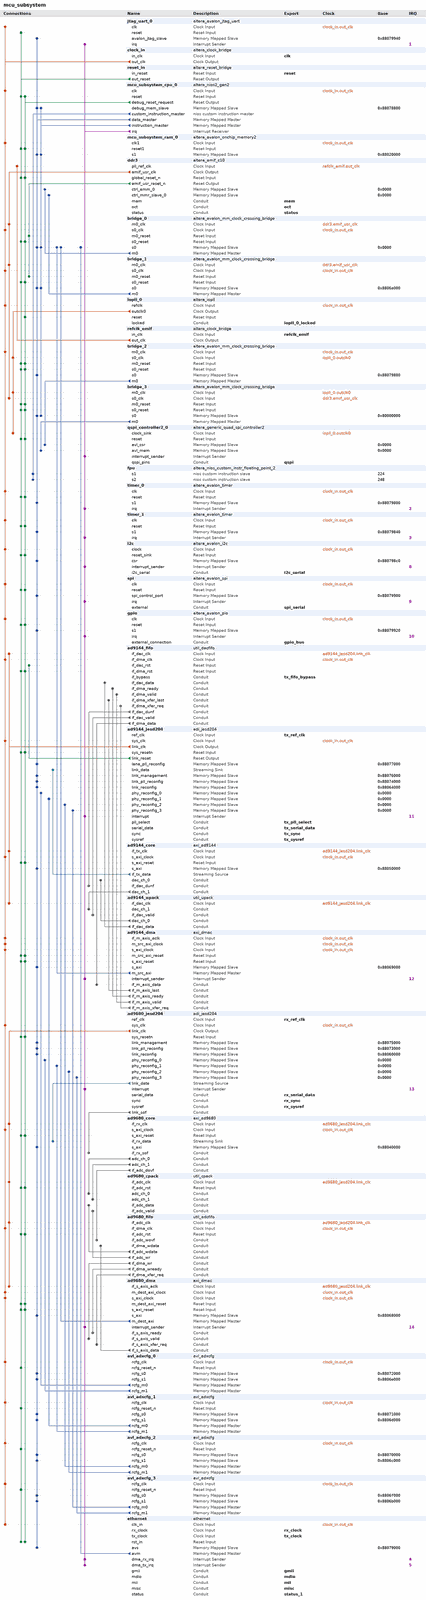
[diagram p0: system contents, whole]
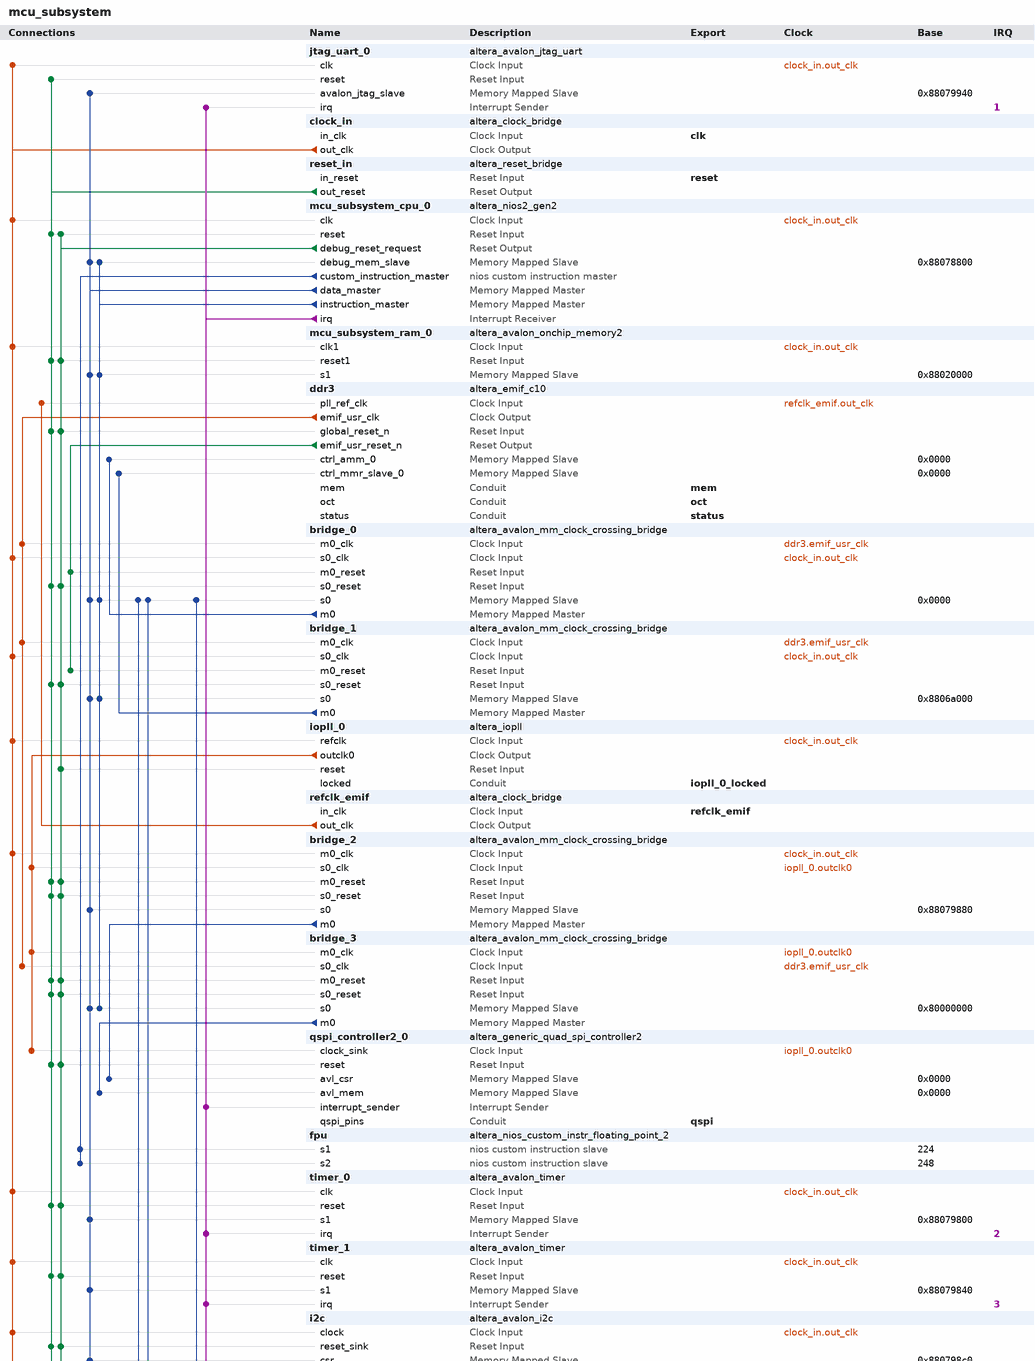
[diagram p1: system contents, upper part]
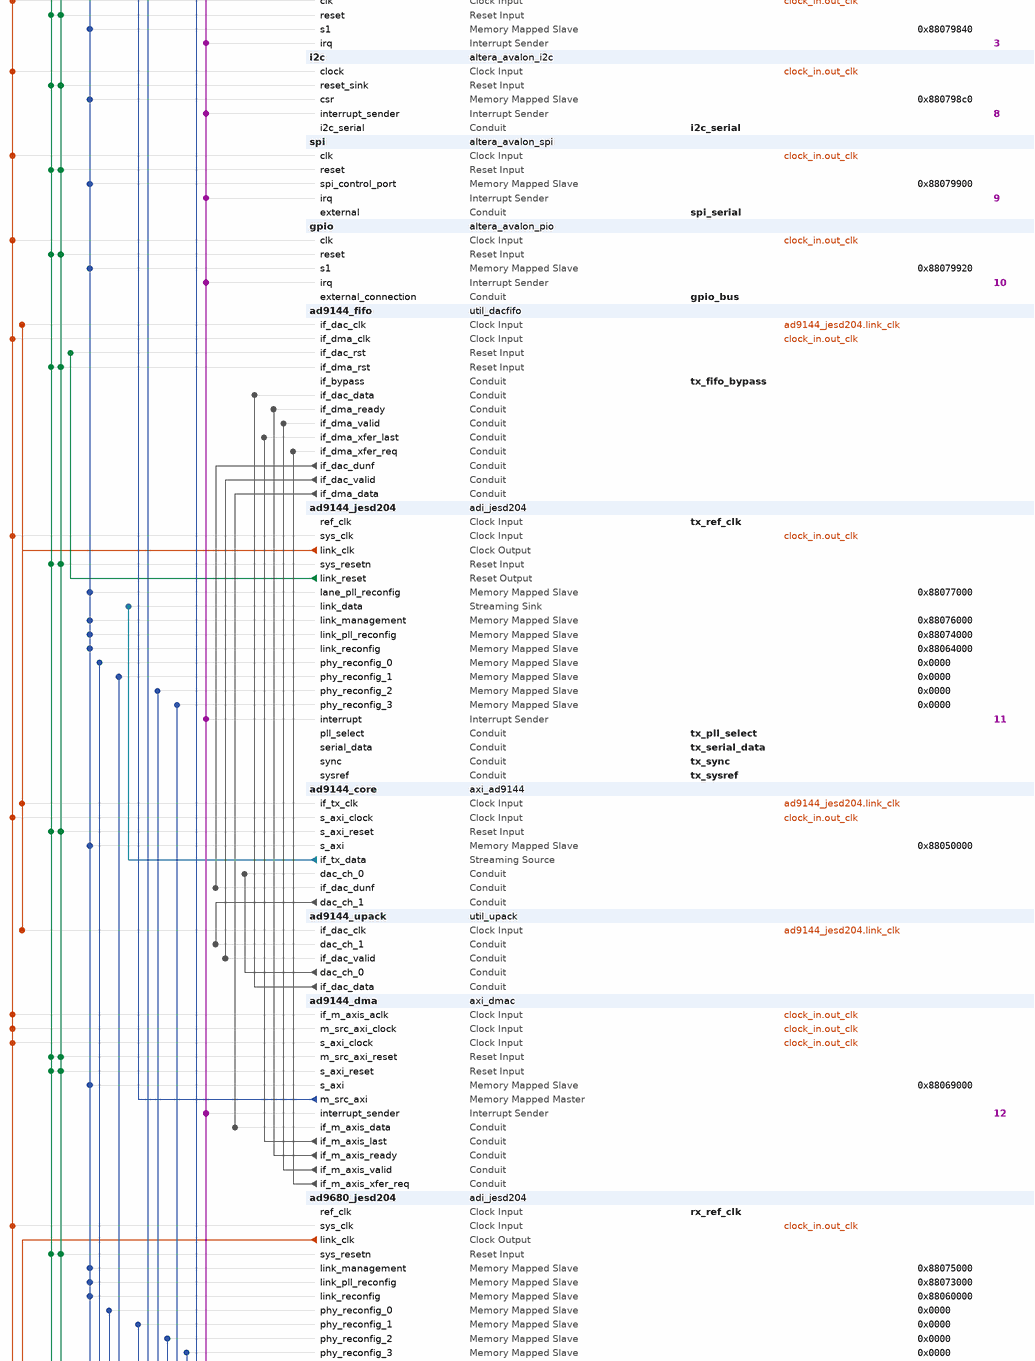
[diagram p2: system contents, middle part]
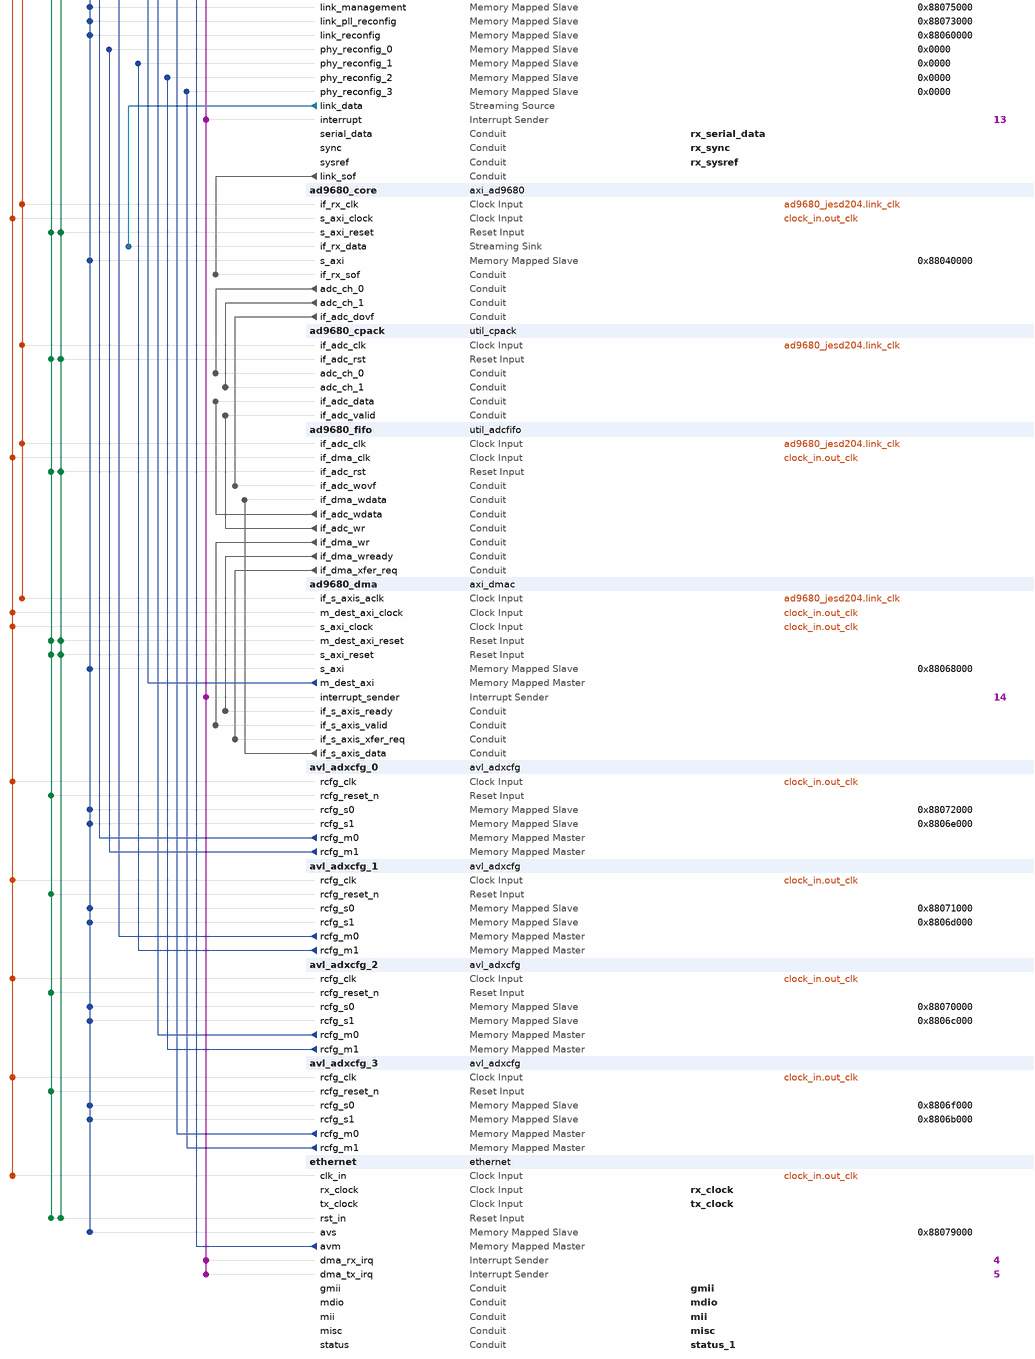
[diagram p3: system contents, lower part]
# Platform Designer (Qsys) system mcu_subsystem, Cyclone 10 GX 10CX220YF780I5G
# Parameters at their usual value, and those the tool derives, are not listed.
package require -exact qsys 1.0
create_system mcu_subsystem
set_project_property DEVICE_FAMILY {Cyclone 10 GX}
set_project_property DEVICE 10CX220YF780I5G

add_component jtag_uart_0 ip/mcu_subsystem/mcu_subsystem_jtag_uart_0.ip altera_avalon_jtag_uart jtag_uart_0 18.1
load_component jtag_uart_0
set_component_parameter_value simInteractiveOptions NO_INTERACTIVE_WINDOWS
save_component

add_component clock_in ip/mcu_subsystem/mcu_subsystem_clock_in.ip altera_clock_bridge clock_in 18.1

add_component reset_in ip/mcu_subsystem/mcu_subsystem_reset_in.ip altera_reset_bridge reset_in 18.1

add_component mcu_subsystem_cpu_0 ip/mcu_subsystem/mcu_subsystem_cpu_0.ip altera_nios2_gen2 mcu_subsystem_cpu_0 18.1
load_component mcu_subsystem_cpu_0
set_component_parameter_value setting_support31bitdcachebypass false
set_component_parameter_value resetSlave ddr3.ctrl_amm_0
set_component_parameter_value exceptionSlave ddr3.ctrl_amm_0
set_component_parameter_value mul_shift_choice 1
set_component_parameter_value mul_64_impl 1
set_component_parameter_value dividerType srt2
set_component_parameter_value impl Fast
set_component_parameter_value icache_size 4096
set_component_parameter_value dcache_size 2048
save_component

add_component mcu_subsystem_ram_0 ip/mcu_subsystem/mcu_subsystem_ram_0.ip altera_avalon_onchip_memory2 mcu_subsystem_ram_0 18.1

add_component ddr3 ip/mcu_subsystem/ddr3.ip altera_emif_c10 ddr3 18.1
load_component ddr3
set_component_parameter_value FAMILY_ENUM FAMILY_CYCLONE10GX
set_component_parameter_value TRAIT_SUPPORTS_VID 0
set_component_parameter_value PROTOCOL_ENUM PROTOCOL_DDR3
set_component_parameter_value IS_ED_SLAVE false
set_component_parameter_value INTERNAL_TESTING_MODE false
set_component_parameter_value CAL_DEBUG_CLOCK_FREQUENCY 50000000
set_component_parameter_value PREV_PROTOCOL_ENUM PROTOCOL_DDR3
set_component_parameter_value PHY_FPGA_SPEEDGRADE_GUI {I5 (Production) - change device under 'View'->'Device Family'}
set_component_parameter_value PHY_TARGET_SPEEDGRADE I5
set_component_parameter_value PHY_TARGET_IS_ES false
set_component_parameter_value PHY_TARGET_IS_ES2 false
set_component_parameter_value PHY_TARGET_IS_ES3 false
set_component_parameter_value PHY_TARGET_IS_PRODUCTION true
set_component_parameter_value PHY_CONFIG_ENUM CONFIG_PHY_AND_HARD_CTRL
set_component_parameter_value PHY_PING_PONG_EN false
set_component_parameter_value PHY_CLAMSHELL_EN false
set_component_parameter_value PHY_RATE_ENUM RATE_QUARTER
set_component_parameter_value PHY_MEM_CLK_FREQ_MHZ 800.0
set_component_parameter_value PHY_REF_CLK_FREQ_MHZ 200.0
set_component_parameter_value PHY_REF_CLK_JITTER_PS 10.0
set_component_parameter_value PHY_CORE_CLKS_SHARING_ENUM CORE_CLKS_SHARING_DISABLED
set_component_parameter_value PHY_CORE_CLKS_SHARING_EXPOSE_SLAVE_OUT false
set_component_parameter_value PHY_CALIBRATED_OCT true
set_component_parameter_value PHY_AC_CALIBRATED_OCT false
set_component_parameter_value PHY_CK_CALIBRATED_OCT false
set_component_parameter_value PHY_DATA_CALIBRATED_OCT true
set_component_parameter_value PHY_RZQ 240
set_component_parameter_value PHY_HPS_ENABLE_EARLY_RELEASE false
set_component_parameter_value PHY_USER_PERIODIC_OCT_RECAL_ENUM PERIODIC_OCT_RECAL_AUTO
set_component_parameter_value PHY_AC_IO_STD_ENUM IO_STD_SSTL_135_C1
set_component_parameter_value PHY_CK_IO_STD_ENUM IO_STD_SSTL_135_C1
set_component_parameter_value PHY_DATA_IO_STD_ENUM IO_STD_SSTL_135
set_component_parameter_value PHY_AC_MODE_ENUM CURRENT_ST_12
set_component_parameter_value PHY_CK_MODE_ENUM CURRENT_ST_12
set_component_parameter_value PHY_DATA_OUT_MODE_ENUM OUT_OCT_34_CAL
set_component_parameter_value PLL_ADD_EXTRA_CLKS false
set_component_parameter_value PLL_USER_NUM_OF_EXTRA_CLKS 0
set_component_parameter_value PLL_EXTRA_CLK_ACTUAL_FREQ_MHZ_GUI_0 0.0
set_component_parameter_value PLL_EXTRA_CLK_ACTUAL_PHASE_PS_GUI_0 0.0
set_component_parameter_value PLL_EXTRA_CLK_DESIRED_FREQ_MHZ_GUI_0 0.0
set_component_parameter_value PLL_EXTRA_CLK_PHASE_SHIFT_UNIT_GUI_0 ps
set_component_parameter_value PLL_EXTRA_CLK_DESIRED_PHASE_GUI_0 0.0
set_component_parameter_value PLL_EXTRA_CLK_ACTUAL_PHASE_DEG_GUI_0 0.0
set_component_parameter_value PLL_EXTRA_CLK_DESIRED_DUTY_CYCLE_GUI_0 50.0
set_component_parameter_value PLL_EXTRA_CLK_ACTUAL_DUTY_CYCLE_GUI_0 50.0
set_component_parameter_value PLL_EXTRA_CLK_ACTUAL_DUTY_CYCLE_0 50.0
set_component_parameter_value PLL_EXTRA_CLK_ACTUAL_FREQ_MHZ_GUI_1 0.0
set_component_parameter_value PLL_EXTRA_CLK_ACTUAL_PHASE_PS_GUI_1 0.0
set_component_parameter_value PLL_EXTRA_CLK_DESIRED_FREQ_MHZ_GUI_1 0.0
set_component_parameter_value PLL_EXTRA_CLK_PHASE_SHIFT_UNIT_GUI_1 ps
set_component_parameter_value PLL_EXTRA_CLK_DESIRED_PHASE_GUI_1 0.0
set_component_parameter_value PLL_EXTRA_CLK_ACTUAL_PHASE_DEG_GUI_1 0.0
set_component_parameter_value PLL_EXTRA_CLK_DESIRED_DUTY_CYCLE_GUI_1 50.0
set_component_parameter_value PLL_EXTRA_CLK_ACTUAL_DUTY_CYCLE_GUI_1 50.0
set_component_parameter_value PLL_EXTRA_CLK_ACTUAL_DUTY_CYCLE_1 50.0
set_component_parameter_value PLL_EXTRA_CLK_ACTUAL_FREQ_MHZ_GUI_2 0.0
set_component_parameter_value PLL_EXTRA_CLK_ACTUAL_PHASE_PS_GUI_2 0.0
set_component_parameter_value PLL_EXTRA_CLK_DESIRED_FREQ_MHZ_GUI_2 0.0
set_component_parameter_value PLL_EXTRA_CLK_PHASE_SHIFT_UNIT_GUI_2 ps
set_component_parameter_value PLL_EXTRA_CLK_DESIRED_PHASE_GUI_2 0.0
set_component_parameter_value PLL_EXTRA_CLK_ACTUAL_PHASE_DEG_GUI_2 0.0
set_component_parameter_value PLL_EXTRA_CLK_DESIRED_DUTY_CYCLE_GUI_2 50.0
set_component_parameter_value PLL_EXTRA_CLK_ACTUAL_DUTY_CYCLE_GUI_2 50.0
set_component_parameter_value PLL_EXTRA_CLK_ACTUAL_DUTY_CYCLE_2 50.0
set_component_parameter_value PLL_EXTRA_CLK_ACTUAL_FREQ_MHZ_GUI_3 0.0
set_component_parameter_value PLL_EXTRA_CLK_ACTUAL_PHASE_PS_GUI_3 0.0
set_component_parameter_value PLL_EXTRA_CLK_DESIRED_FREQ_MHZ_GUI_3 0.0
set_component_parameter_value PLL_EXTRA_CLK_PHASE_SHIFT_UNIT_GUI_3 ps
set_component_parameter_value PLL_EXTRA_CLK_DESIRED_PHASE_GUI_3 0.0
set_component_parameter_value PLL_EXTRA_CLK_ACTUAL_PHASE_DEG_GUI_3 0.0
set_component_parameter_value PLL_EXTRA_CLK_DESIRED_DUTY_CYCLE_GUI_3 50.0
set_component_parameter_value PLL_EXTRA_CLK_ACTUAL_DUTY_CYCLE_GUI_3 50.0
set_component_parameter_value PLL_EXTRA_CLK_ACTUAL_DUTY_CYCLE_3 50.0
set_component_parameter_value PLL_EXTRA_CLK_ACTUAL_FREQ_MHZ_GUI_4 0.0
set_component_parameter_value PLL_EXTRA_CLK_ACTUAL_PHASE_PS_GUI_4 0.0
set_component_parameter_value PLL_EXTRA_CLK_DESIRED_FREQ_MHZ_GUI_4 0.0
set_component_parameter_value PLL_EXTRA_CLK_PHASE_SHIFT_UNIT_GUI_4 ps
set_component_parameter_value PLL_EXTRA_CLK_DESIRED_PHASE_GUI_4 0.0
set_component_parameter_value PLL_EXTRA_CLK_ACTUAL_PHASE_DEG_GUI_4 0.0
set_component_parameter_value PLL_EXTRA_CLK_DESIRED_DUTY_CYCLE_GUI_4 50.0
set_component_parameter_value PLL_EXTRA_CLK_ACTUAL_DUTY_CYCLE_GUI_4 50.0
set_component_parameter_value PLL_EXTRA_CLK_ACTUAL_DUTY_CYCLE_4 50.0
set_component_parameter_value PLL_EXTRA_CLK_ACTUAL_FREQ_MHZ_GUI_5 0.0
set_component_parameter_value PLL_EXTRA_CLK_ACTUAL_PHASE_PS_GUI_5 0.0
set_component_parameter_value PLL_EXTRA_CLK_DESIRED_FREQ_MHZ_GUI_5 0.0
set_component_parameter_value PLL_EXTRA_CLK_PHASE_SHIFT_UNIT_GUI_5 ps
set_component_parameter_value PLL_EXTRA_CLK_DESIRED_PHASE_GUI_5 0.0
set_component_parameter_value PLL_EXTRA_CLK_ACTUAL_PHASE_DEG_GUI_5 0.0
set_component_parameter_value PLL_EXTRA_CLK_DESIRED_DUTY_CYCLE_GUI_5 50.0
set_component_parameter_value PLL_EXTRA_CLK_ACTUAL_DUTY_CYCLE_GUI_5 50.0
set_component_parameter_value PLL_EXTRA_CLK_ACTUAL_DUTY_CYCLE_5 50.0
set_component_parameter_value PLL_EXTRA_CLK_ACTUAL_FREQ_MHZ_GUI_6 0.0
set_component_parameter_value PLL_EXTRA_CLK_ACTUAL_PHASE_PS_GUI_6 0.0
set_component_parameter_value PLL_EXTRA_CLK_DESIRED_FREQ_MHZ_GUI_6 0.0
set_component_parameter_value PLL_EXTRA_CLK_PHASE_SHIFT_UNIT_GUI_6 ps
set_component_parameter_value PLL_EXTRA_CLK_DESIRED_PHASE_GUI_6 0.0
set_component_parameter_value PLL_EXTRA_CLK_ACTUAL_PHASE_DEG_GUI_6 0.0
set_component_parameter_value PLL_EXTRA_CLK_DESIRED_DUTY_CYCLE_GUI_6 50.0
set_component_parameter_value PLL_EXTRA_CLK_ACTUAL_DUTY_CYCLE_GUI_6 50.0
set_component_parameter_value PLL_EXTRA_CLK_ACTUAL_DUTY_CYCLE_6 50.0
set_component_parameter_value PLL_EXTRA_CLK_ACTUAL_FREQ_MHZ_GUI_7 0.0
set_component_parameter_value PLL_EXTRA_CLK_ACTUAL_PHASE_PS_GUI_7 0.0
set_component_parameter_value PLL_EXTRA_CLK_DESIRED_FREQ_MHZ_GUI_7 0.0
set_component_parameter_value PLL_EXTRA_CLK_PHASE_SHIFT_UNIT_GUI_7 ps
set_component_parameter_value PLL_EXTRA_CLK_DESIRED_PHASE_GUI_7 0.0
set_component_parameter_value PLL_EXTRA_CLK_ACTUAL_PHASE_DEG_GUI_7 0.0
set_component_parameter_value PLL_EXTRA_CLK_DESIRED_DUTY_CYCLE_GUI_7 50.0
set_component_parameter_value PLL_EXTRA_CLK_ACTUAL_DUTY_CYCLE_GUI_7 50.0
set_component_parameter_value PLL_EXTRA_CLK_ACTUAL_DUTY_CYCLE_7 50.0
set_component_parameter_value PLL_EXTRA_CLK_ACTUAL_FREQ_MHZ_GUI_8 0.0
set_component_parameter_value PLL_EXTRA_CLK_ACTUAL_PHASE_PS_GUI_8 0.0
set_component_parameter_value PLL_EXTRA_CLK_DESIRED_FREQ_MHZ_GUI_8 0.0
set_component_parameter_value PLL_EXTRA_CLK_PHASE_SHIFT_UNIT_GUI_8 ps
set_component_parameter_value PLL_EXTRA_CLK_DESIRED_PHASE_GUI_8 0.0
set_component_parameter_value PLL_EXTRA_CLK_ACTUAL_PHASE_DEG_GUI_8 0.0
set_component_parameter_value PLL_EXTRA_CLK_DESIRED_DUTY_CYCLE_GUI_8 50.0
set_component_parameter_value PLL_EXTRA_CLK_ACTUAL_DUTY_CYCLE_GUI_8 50.0
set_component_parameter_value PLL_EXTRA_CLK_ACTUAL_DUTY_CYCLE_8 50.0
set_component_parameter_value PLL_VCO_CLK_FREQ_MHZ 800.0
set_component_parameter_value PLL_NUM_OF_EXTRA_CLKS 0
set_component_parameter_value PLL_EXTRA_CLK_ACTUAL_FREQ_MHZ_0 0.0
set_component_parameter_value PLL_EXTRA_CLK_ACTUAL_PHASE_PS_0 0.0
set_component_parameter_value PLL_EXTRA_CLK_ACTUAL_FREQ_MHZ_1 0.0
set_component_parameter_value PLL_EXTRA_CLK_ACTUAL_PHASE_PS_1 0.0
set_component_parameter_value PLL_EXTRA_CLK_ACTUAL_FREQ_MHZ_2 0.0
set_component_parameter_value PLL_EXTRA_CLK_ACTUAL_PHASE_PS_2 0.0
set_component_parameter_value PLL_EXTRA_CLK_ACTUAL_FREQ_MHZ_3 0.0
set_component_parameter_value PLL_EXTRA_CLK_ACTUAL_PHASE_PS_3 0.0
set_component_parameter_value PLL_EXTRA_CLK_ACTUAL_FREQ_MHZ_4 0.0
set_component_parameter_value PLL_EXTRA_CLK_ACTUAL_PHASE_PS_4 0.0
set_component_parameter_value PLL_EXTRA_CLK_ACTUAL_FREQ_MHZ_5 800.0
set_component_parameter_value PLL_EXTRA_CLK_ACTUAL_PHASE_PS_5 0.0
set_component_parameter_value PLL_EXTRA_CLK_ACTUAL_FREQ_MHZ_6 800.0
set_component_parameter_value PLL_EXTRA_CLK_ACTUAL_PHASE_PS_6 0.0
set_component_parameter_value PLL_EXTRA_CLK_ACTUAL_FREQ_MHZ_7 800.0
set_component_parameter_value PLL_EXTRA_CLK_ACTUAL_PHASE_PS_7 0.0
set_component_parameter_value PLL_EXTRA_CLK_ACTUAL_FREQ_MHZ_8 800.0
set_component_parameter_value PLL_EXTRA_CLK_ACTUAL_PHASE_PS_8 0.0
set_component_parameter_value PHY_DDR3_CONFIG_ENUM CONFIG_PHY_AND_HARD_CTRL
set_component_parameter_value PHY_DDR3_USER_PING_PONG_EN false
set_component_parameter_value PHY_DDR3_MEM_CLK_FREQ_MHZ 800.0
set_component_parameter_value PHY_DDR3_DEFAULT_REF_CLK_FREQ false
set_component_parameter_value PHY_DDR3_USER_REF_CLK_FREQ_MHZ 200.0
set_component_parameter_value PHY_DDR3_REF_CLK_JITTER_PS 10.0
set_component_parameter_value PHY_DDR3_RATE_ENUM RATE_QUARTER
set_component_parameter_value PHY_DDR3_CORE_CLKS_SHARING_ENUM CORE_CLKS_SHARING_DISABLED
set_component_parameter_value PHY_DDR3_CORE_CLKS_SHARING_EXPOSE_SLAVE_OUT false
set_component_parameter_value PHY_DDR3_IO_VOLTAGE 1.35
set_component_parameter_value PHY_DDR3_DEFAULT_IO true
set_component_parameter_value PHY_DDR3_HPS_ENABLE_EARLY_RELEASE false
set_component_parameter_value PHY_DDR3_USER_PERIODIC_OCT_RECAL_ENUM PERIODIC_OCT_RECAL_AUTO
set_component_parameter_value PHY_DDR3_REF_CLK_FREQ_MHZ 200.0
set_component_parameter_value PHY_DDR3_PING_PONG_EN false
set_component_parameter_value PHY_DDR3_USER_AC_IO_STD_ENUM IO_STD_SSTL_15_C1
set_component_parameter_value PHY_DDR3_USER_AC_MODE_ENUM CURRENT_ST_12
set_component_parameter_value PHY_DDR3_USER_AC_SLEW_RATE_ENUM SLEW_RATE_FAST
set_component_parameter_value PHY_DDR3_USER_CK_IO_STD_ENUM IO_STD_SSTL_15_C1
set_component_parameter_value PHY_DDR3_USER_CK_MODE_ENUM CURRENT_ST_12
set_component_parameter_value PHY_DDR3_USER_CK_SLEW_RATE_ENUM SLEW_RATE_FAST
set_component_parameter_value PHY_DDR3_USER_DATA_IO_STD_ENUM IO_STD_SSTL_15
set_component_parameter_value PHY_DDR3_USER_DATA_OUT_MODE_ENUM OUT_OCT_34_CAL
set_component_parameter_value PHY_DDR3_USER_DATA_IN_MODE_ENUM IN_OCT_120_CAL
set_component_parameter_value PHY_DDR3_USER_AUTO_STARTING_VREFIN_EN true
set_component_parameter_value PHY_DDR3_USER_STARTING_VREFIN 50.0
set_component_parameter_value PHY_DDR3_USER_PLL_REF_CLK_IO_STD_ENUM IO_STD_LVDS
set_component_parameter_value PHY_DDR3_USER_RZQ_IO_STD_ENUM IO_STD_CMOS_15
set_component_parameter_value PHY_DDR3_AC_IO_STD_ENUM IO_STD_SSTL_135_C1
set_component_parameter_value PHY_DDR3_AC_MODE_ENUM CURRENT_ST_12
set_component_parameter_value PHY_DDR3_AC_SLEW_RATE_ENUM SLEW_RATE_SLOW
set_component_parameter_value PHY_DDR3_CK_IO_STD_ENUM IO_STD_SSTL_135_C1
set_component_parameter_value PHY_DDR3_CK_MODE_ENUM CURRENT_ST_12
set_component_parameter_value PHY_DDR3_CK_SLEW_RATE_ENUM SLEW_RATE_SLOW
set_component_parameter_value PHY_DDR3_DATA_IO_STD_ENUM IO_STD_SSTL_135
set_component_parameter_value PHY_DDR3_DATA_OUT_MODE_ENUM OUT_OCT_34_CAL
set_component_parameter_value PHY_DDR3_DATA_IN_MODE_ENUM IN_OCT_120_CAL
set_component_parameter_value PHY_DDR3_AUTO_STARTING_VREFIN_EN true
set_component_parameter_value PHY_DDR3_STARTING_VREFIN 50.0
set_component_parameter_value PHY_DDR3_PLL_REF_CLK_IO_STD_ENUM IO_STD_LVDS
set_component_parameter_value PHY_DDR3_RZQ_IO_STD_ENUM IO_STD_SSTL_135
set_component_parameter_value PHY_DDR3_CAL_ADDR0 0
set_component_parameter_value PHY_DDR3_CAL_ADDR1 8
set_component_parameter_value PHY_DDR3_CAL_ENABLE_NON_DES false
set_component_parameter_value PHY_DDR4_CONFIG_ENUM CONFIG_PHY_AND_HARD_CTRL
set_component_parameter_value PHY_DDR4_USER_PING_PONG_EN false
set_component_parameter_value PHY_DDR4_USER_CLAMSHELL_EN false
set_component_parameter_value PHY_DDR4_MEM_CLK_FREQ_MHZ 1200.0
set_component_parameter_value PHY_DDR4_DEFAULT_REF_CLK_FREQ true
set_component_parameter_value PHY_DDR4_USER_REF_CLK_FREQ_MHZ -1.0
set_component_parameter_value PHY_DDR4_REF_CLK_JITTER_PS 10.0
set_component_parameter_value PHY_DDR4_RATE_ENUM RATE_QUARTER
set_component_parameter_value PHY_DDR4_CORE_CLKS_SHARING_ENUM CORE_CLKS_SHARING_DISABLED
set_component_parameter_value PHY_DDR4_CORE_CLKS_SHARING_EXPOSE_SLAVE_OUT false
set_component_parameter_value PHY_DDR4_IO_VOLTAGE 1.2
set_component_parameter_value PHY_DDR4_DEFAULT_IO true
set_component_parameter_value PHY_DDR4_HPS_ENABLE_EARLY_RELEASE false
set_component_parameter_value PHY_DDR4_USER_PERIODIC_OCT_RECAL_ENUM PERIODIC_OCT_RECAL_AUTO
set_component_parameter_value PHY_DDR4_REF_CLK_FREQ_MHZ -1.0
set_component_parameter_value PHY_DDR4_PING_PONG_EN false
set_component_parameter_value PHY_DDR4_CLAMSHELL_EN false
set_component_parameter_value PHY_DDR4_USER_AC_IO_STD_ENUM unset
set_component_parameter_value PHY_DDR4_USER_AC_MODE_ENUM unset
set_component_parameter_value PHY_DDR4_USER_AC_SLEW_RATE_ENUM SLEW_RATE_FAST
set_component_parameter_value PHY_DDR4_USER_CK_IO_STD_ENUM unset
set_component_parameter_value PHY_DDR4_USER_CK_MODE_ENUM unset
set_component_parameter_value PHY_DDR4_USER_CK_SLEW_RATE_ENUM SLEW_RATE_FAST
set_component_parameter_value PHY_DDR4_USER_DATA_IO_STD_ENUM unset
set_component_parameter_value PHY_DDR4_USER_DATA_OUT_MODE_ENUM unset
set_component_parameter_value PHY_DDR4_USER_DATA_IN_MODE_ENUM unset
set_component_parameter_value PHY_DDR4_USER_AUTO_STARTING_VREFIN_EN true
set_component_parameter_value PHY_DDR4_USER_STARTING_VREFIN 70.0
set_component_parameter_value PHY_DDR4_USER_PLL_REF_CLK_IO_STD_ENUM unset
set_component_parameter_value PHY_DDR4_USER_RZQ_IO_STD_ENUM unset
set_component_parameter_value PHY_DDR4_AC_IO_STD_ENUM unset
set_component_parameter_value PHY_DDR4_AC_MODE_ENUM unset
set_component_parameter_value PHY_DDR4_AC_SLEW_RATE_ENUM SLEW_RATE_FAST
set_component_parameter_value PHY_DDR4_CK_IO_STD_ENUM unset
set_component_parameter_value PHY_DDR4_CK_MODE_ENUM unset
set_component_parameter_value PHY_DDR4_CK_SLEW_RATE_ENUM SLEW_RATE_FAST
set_component_parameter_value PHY_DDR4_DATA_IO_STD_ENUM unset
set_component_parameter_value PHY_DDR4_DATA_OUT_MODE_ENUM unset
set_component_parameter_value PHY_DDR4_DATA_IN_MODE_ENUM unset
set_component_parameter_value PHY_DDR4_AUTO_STARTING_VREFIN_EN true
set_component_parameter_value PHY_DDR4_STARTING_VREFIN 70.0
set_component_parameter_value PHY_DDR4_PLL_REF_CLK_IO_STD_ENUM unset
set_component_parameter_value PHY_DDR4_RZQ_IO_STD_ENUM unset
set_component_parameter_value PHY_QDR2_CONFIG_ENUM CONFIG_PHY_AND_SOFT_CTRL
set_component_parameter_value PHY_QDR2_USER_PING_PONG_EN false
set_component_parameter_value PHY_QDR2_MEM_CLK_FREQ_MHZ 633.333
set_component_parameter_value PHY_QDR2_DEFAULT_REF_CLK_FREQ true
set_component_parameter_value PHY_QDR2_USER_REF_CLK_FREQ_MHZ -1.0
set_component_parameter_value PHY_QDR2_REF_CLK_JITTER_PS 10.0
set_component_parameter_value PHY_QDR2_RATE_ENUM RATE_HALF
set_component_parameter_value PHY_QDR2_CORE_CLKS_SHARING_ENUM CORE_CLKS_SHARING_DISABLED
set_component_parameter_value PHY_QDR2_CORE_CLKS_SHARING_EXPOSE_SLAVE_OUT false
set_component_parameter_value PHY_QDR2_IO_VOLTAGE 1.5
set_component_parameter_value PHY_QDR2_DEFAULT_IO true
set_component_parameter_value PHY_QDR2_HPS_ENABLE_EARLY_RELEASE false
set_component_parameter_value PHY_QDR2_USER_PERIODIC_OCT_RECAL_ENUM PERIODIC_OCT_RECAL_AUTO
set_component_parameter_value PHY_QDR2_REF_CLK_FREQ_MHZ -1.0
set_component_parameter_value PHY_QDR2_PING_PONG_EN false
set_component_parameter_value PHY_QDR2_USER_AC_IO_STD_ENUM unset
set_component_parameter_value PHY_QDR2_USER_AC_MODE_ENUM unset
set_component_parameter_value PHY_QDR2_USER_AC_SLEW_RATE_ENUM SLEW_RATE_FAST
set_component_parameter_value PHY_QDR2_USER_CK_IO_STD_ENUM unset
set_component_parameter_value PHY_QDR2_USER_CK_MODE_ENUM unset
set_component_parameter_value PHY_QDR2_USER_CK_SLEW_RATE_ENUM SLEW_RATE_FAST
set_component_parameter_value PHY_QDR2_USER_DATA_IO_STD_ENUM unset
set_component_parameter_value PHY_QDR2_USER_DATA_OUT_MODE_ENUM unset
set_component_parameter_value PHY_QDR2_USER_DATA_IN_MODE_ENUM unset
set_component_parameter_value PHY_QDR2_USER_AUTO_STARTING_VREFIN_EN true
set_component_parameter_value PHY_QDR2_USER_STARTING_VREFIN 70.0
set_component_parameter_value PHY_QDR2_USER_PLL_REF_CLK_IO_STD_ENUM unset
set_component_parameter_value PHY_QDR2_USER_RZQ_IO_STD_ENUM unset
set_component_parameter_value PHY_QDR2_AC_IO_STD_ENUM unset
set_component_parameter_value PHY_QDR2_AC_MODE_ENUM unset
set_component_parameter_value PHY_QDR2_AC_SLEW_RATE_ENUM SLEW_RATE_FAST
set_component_parameter_value PHY_QDR2_CK_IO_STD_ENUM unset
set_component_parameter_value PHY_QDR2_CK_MODE_ENUM unset
set_component_parameter_value PHY_QDR2_CK_SLEW_RATE_ENUM SLEW_RATE_FAST
set_component_parameter_value PHY_QDR2_DATA_IO_STD_ENUM unset
set_component_parameter_value PHY_QDR2_DATA_OUT_MODE_ENUM unset
set_component_parameter_value PHY_QDR2_DATA_IN_MODE_ENUM unset
set_component_parameter_value PHY_QDR2_AUTO_STARTING_VREFIN_EN true
set_component_parameter_value PHY_QDR2_STARTING_VREFIN 70.0
set_component_parameter_value PHY_QDR2_PLL_REF_CLK_IO_STD_ENUM unset
set_component_parameter_value PHY_QDR2_RZQ_IO_STD_ENUM unset
set_component_parameter_value PHY_QDR4_CONFIG_ENUM CONFIG_PHY_AND_SOFT_CTRL
set_component_parameter_value PHY_QDR4_USER_PING_PONG_EN false
set_component_parameter_value PHY_QDR4_MEM_CLK_FREQ_MHZ 1066.667
set_component_parameter_value PHY_QDR4_DEFAULT_REF_CLK_FREQ true
set_component_parameter_value PHY_QDR4_USER_REF_CLK_FREQ_MHZ -1.0
set_component_parameter_value PHY_QDR4_REF_CLK_JITTER_PS 10.0
set_component_parameter_value PHY_QDR4_RATE_ENUM RATE_QUARTER
set_component_parameter_value PHY_QDR4_CORE_CLKS_SHARING_ENUM CORE_CLKS_SHARING_DISABLED
set_component_parameter_value PHY_QDR4_CORE_CLKS_SHARING_EXPOSE_SLAVE_OUT false
set_component_parameter_value PHY_QDR4_IO_VOLTAGE 1.2
set_component_parameter_value PHY_QDR4_DEFAULT_IO true
set_component_parameter_value PHY_QDR4_HPS_ENABLE_EARLY_RELEASE false
set_component_parameter_value PHY_QDR4_USER_PERIODIC_OCT_RECAL_ENUM PERIODIC_OCT_RECAL_AUTO
set_component_parameter_value PHY_QDR4_REF_CLK_FREQ_MHZ -1.0
set_component_parameter_value PHY_QDR4_PING_PONG_EN false
set_component_parameter_value PHY_QDR4_USER_AC_IO_STD_ENUM unset
set_component_parameter_value PHY_QDR4_USER_AC_MODE_ENUM unset
set_component_parameter_value PHY_QDR4_USER_AC_SLEW_RATE_ENUM SLEW_RATE_FAST
set_component_parameter_value PHY_QDR4_USER_CK_IO_STD_ENUM unset
set_component_parameter_value PHY_QDR4_USER_CK_MODE_ENUM unset
set_component_parameter_value PHY_QDR4_USER_CK_SLEW_RATE_ENUM SLEW_RATE_FAST
set_component_parameter_value PHY_QDR4_USER_DATA_IO_STD_ENUM unset
set_component_parameter_value PHY_QDR4_USER_DATA_OUT_MODE_ENUM unset
set_component_parameter_value PHY_QDR4_USER_DATA_IN_MODE_ENUM unset
set_component_parameter_value PHY_QDR4_USER_AUTO_STARTING_VREFIN_EN true
set_component_parameter_value PHY_QDR4_USER_STARTING_VREFIN 70.0
set_component_parameter_value PHY_QDR4_USER_PLL_REF_CLK_IO_STD_ENUM unset
set_component_parameter_value PHY_QDR4_USER_RZQ_IO_STD_ENUM unset
set_component_parameter_value PHY_QDR4_AC_IO_STD_ENUM unset
set_component_parameter_value PHY_QDR4_AC_MODE_ENUM unset
set_component_parameter_value PHY_QDR4_AC_SLEW_RATE_ENUM SLEW_RATE_FAST
set_component_parameter_value PHY_QDR4_CK_IO_STD_ENUM unset
set_component_parameter_value PHY_QDR4_CK_MODE_ENUM unset
set_component_parameter_value PHY_QDR4_CK_SLEW_RATE_ENUM SLEW_RATE_FAST
set_component_parameter_value PHY_QDR4_DATA_IO_STD_ENUM unset
set_component_parameter_value PHY_QDR4_DATA_OUT_MODE_ENUM unset
set_component_parameter_value PHY_QDR4_DATA_IN_MODE_ENUM unset
set_component_parameter_value PHY_QDR4_AUTO_STARTING_VREFIN_EN true
set_component_parameter_value PHY_QDR4_STARTING_VREFIN 70.0
set_component_parameter_value PHY_QDR4_PLL_REF_CLK_IO_STD_ENUM unset
set_component_parameter_value PHY_QDR4_RZQ_IO_STD_ENUM unset
set_component_parameter_value PHY_RLD2_CONFIG_ENUM CONFIG_PHY_AND_SOFT_CTRL
set_component_parameter_value PHY_RLD2_USER_PING_PONG_EN false
set_component_parameter_value PHY_RLD2_MEM_CLK_FREQ_MHZ 533.333
set_component_parameter_value PHY_RLD2_DEFAULT_REF_CLK_FREQ true
set_component_parameter_value PHY_RLD2_USER_REF_CLK_FREQ_MHZ -1.0
set_component_parameter_value PHY_RLD2_REF_CLK_JITTER_PS 10.0
set_component_parameter_value PHY_RLD2_RATE_ENUM RATE_HALF
set_component_parameter_value PHY_RLD2_CORE_CLKS_SHARING_ENUM CORE_CLKS_SHARING_DISABLED
set_component_parameter_value PHY_RLD2_CORE_CLKS_SHARING_EXPOSE_SLAVE_OUT false
set_component_parameter_value PHY_RLD2_IO_VOLTAGE 1.8
set_component_parameter_value PHY_RLD2_DEFAULT_IO true
set_component_parameter_value PHY_RLD2_HPS_ENABLE_EARLY_RELEASE false
set_component_parameter_value PHY_RLD2_USER_PERIODIC_OCT_RECAL_ENUM PERIODIC_OCT_RECAL_AUTO
set_component_parameter_value PHY_RLD2_REF_CLK_FREQ_MHZ -1.0
set_component_parameter_value PHY_RLD2_PING_PONG_EN false
set_component_parameter_value PHY_RLD2_USER_AC_IO_STD_ENUM unset
set_component_parameter_value PHY_RLD2_USER_AC_MODE_ENUM unset
set_component_parameter_value PHY_RLD2_USER_AC_SLEW_RATE_ENUM SLEW_RATE_FAST
set_component_parameter_value PHY_RLD2_USER_CK_IO_STD_ENUM unset
set_component_parameter_value PHY_RLD2_USER_CK_MODE_ENUM unset
set_component_parameter_value PHY_RLD2_USER_CK_SLEW_RATE_ENUM SLEW_RATE_FAST
set_component_parameter_value PHY_RLD2_USER_DATA_IO_STD_ENUM unset
set_component_parameter_value PHY_RLD2_USER_DATA_OUT_MODE_ENUM unset
set_component_parameter_value PHY_RLD2_USER_DATA_IN_MODE_ENUM unset
set_component_parameter_value PHY_RLD2_USER_AUTO_STARTING_VREFIN_EN true
set_component_parameter_value PHY_RLD2_USER_STARTING_VREFIN 70.0
set_component_parameter_value PHY_RLD2_USER_PLL_REF_CLK_IO_STD_ENUM unset
set_component_parameter_value PHY_RLD2_USER_RZQ_IO_STD_ENUM unset
set_component_parameter_value PHY_RLD2_AC_IO_STD_ENUM unset
set_component_parameter_value PHY_RLD2_AC_MODE_ENUM unset
set_component_parameter_value PHY_RLD2_AC_SLEW_RATE_ENUM SLEW_RATE_FAST
set_component_parameter_value PHY_RLD2_CK_IO_STD_ENUM unset
set_component_parameter_value PHY_RLD2_CK_MODE_ENUM unset
set_component_parameter_value PHY_RLD2_CK_SLEW_RATE_ENUM SLEW_RATE_FAST
set_component_parameter_value PHY_RLD2_DATA_IO_STD_ENUM unset
set_component_parameter_value PHY_RLD2_DATA_OUT_MODE_ENUM unset
set_component_parameter_value PHY_RLD2_DATA_IN_MODE_ENUM unset
set_component_parameter_value PHY_RLD2_AUTO_STARTING_VREFIN_EN true
set_component_parameter_value PHY_RLD2_STARTING_VREFIN 70.0
set_component_parameter_value PHY_RLD2_PLL_REF_CLK_IO_STD_ENUM unset
set_component_parameter_value PHY_RLD2_RZQ_IO_STD_ENUM unset
set_component_parameter_value PHY_RLD3_CONFIG_ENUM CONFIG_PHY_ONLY
set_component_parameter_value PHY_RLD3_USER_PING_PONG_EN false
set_component_parameter_value PHY_RLD3_MEM_CLK_FREQ_MHZ 1066.667
set_component_parameter_value PHY_RLD3_DEFAULT_REF_CLK_FREQ true
set_component_parameter_value PHY_RLD3_USER_REF_CLK_FREQ_MHZ -1.0
set_component_parameter_value PHY_RLD3_REF_CLK_JITTER_PS 10.0
set_component_parameter_value PHY_RLD3_RATE_ENUM RATE_QUARTER
set_component_parameter_value PHY_RLD3_CORE_CLKS_SHARING_ENUM CORE_CLKS_SHARING_DISABLED
set_component_parameter_value PHY_RLD3_CORE_CLKS_SHARING_EXPOSE_SLAVE_OUT false
set_component_parameter_value PHY_RLD3_IO_VOLTAGE 1.2
set_component_parameter_value PHY_RLD3_DEFAULT_IO true
set_component_parameter_value PHY_RLD3_HPS_ENABLE_EARLY_RELEASE false
set_component_parameter_value PHY_RLD3_USER_PERIODIC_OCT_RECAL_ENUM PERIODIC_OCT_RECAL_AUTO
set_component_parameter_value PHY_RLD3_REF_CLK_FREQ_MHZ -1.0
set_component_parameter_value PHY_RLD3_PING_PONG_EN false
set_component_parameter_value PHY_RLD3_USER_AC_IO_STD_ENUM unset
set_component_parameter_value PHY_RLD3_USER_AC_MODE_ENUM unset
set_component_parameter_value PHY_RLD3_USER_AC_SLEW_RATE_ENUM SLEW_RATE_FAST
set_component_parameter_value PHY_RLD3_USER_CK_IO_STD_ENUM unset
set_component_parameter_value PHY_RLD3_USER_CK_MODE_ENUM unset
set_component_parameter_value PHY_RLD3_USER_CK_SLEW_RATE_ENUM SLEW_RATE_FAST
set_component_parameter_value PHY_RLD3_USER_DATA_IO_STD_ENUM unset
set_component_parameter_value PHY_RLD3_USER_DATA_OUT_MODE_ENUM unset
set_component_parameter_value PHY_RLD3_USER_DATA_IN_MODE_ENUM unset
set_component_parameter_value PHY_RLD3_USER_AUTO_STARTING_VREFIN_EN true
set_component_parameter_value PHY_RLD3_USER_STARTING_VREFIN 70.0
set_component_parameter_value PHY_RLD3_USER_PLL_REF_CLK_IO_STD_ENUM unset
set_component_parameter_value PHY_RLD3_USER_RZQ_IO_STD_ENUM unset
set_component_parameter_value PHY_RLD3_AC_IO_STD_ENUM unset
set_component_parameter_value PHY_RLD3_AC_MODE_ENUM unset
set_component_parameter_value PHY_RLD3_AC_SLEW_RATE_ENUM SLEW_RATE_FAST
set_component_parameter_value PHY_RLD3_CK_IO_STD_ENUM unset
set_component_parameter_value PHY_RLD3_CK_MODE_ENUM unset
set_component_parameter_value PHY_RLD3_CK_SLEW_RATE_ENUM SLEW_RATE_FAST
set_component_parameter_value PHY_RLD3_DATA_IO_STD_ENUM unset
set_component_parameter_value PHY_RLD3_DATA_OUT_MODE_ENUM unset
set_component_parameter_value PHY_RLD3_DATA_IN_MODE_ENUM unset
set_component_parameter_value PHY_RLD3_AUTO_STARTING_VREFIN_EN true
set_component_parameter_value PHY_RLD3_STARTING_VREFIN 70.0
set_component_parameter_value PHY_RLD3_PLL_REF_CLK_IO_STD_ENUM unset
set_component_parameter_value PHY_RLD3_RZQ_IO_STD_ENUM unset
set_component_parameter_value PHY_LPDDR3_CONFIG_ENUM CONFIG_PHY_AND_HARD_CTRL
set_component_parameter_value PHY_LPDDR3_USER_PING_PONG_EN false
set_component_parameter_value PHY_LPDDR3_MEM_CLK_FREQ_MHZ 800.0
set_component_parameter_value PHY_LPDDR3_DEFAULT_REF_CLK_FREQ true
set_component_parameter_value PHY_LPDDR3_USER_REF_CLK_FREQ_MHZ -1.0
set_component_parameter_value PHY_LPDDR3_REF_CLK_JITTER_PS 10.0
set_component_parameter_value PHY_LPDDR3_RATE_ENUM RATE_QUARTER
set_component_parameter_value PHY_LPDDR3_CORE_CLKS_SHARING_ENUM CORE_CLKS_SHARING_DISABLED
set_component_parameter_value PHY_LPDDR3_CORE_CLKS_SHARING_EXPOSE_SLAVE_OUT false
set_component_parameter_value PHY_LPDDR3_IO_VOLTAGE 1.2
set_component_parameter_value PHY_LPDDR3_DEFAULT_IO true
set_component_parameter_value PHY_LPDDR3_HPS_ENABLE_EARLY_RELEASE false
set_component_parameter_value PHY_LPDDR3_USER_PERIODIC_OCT_RECAL_ENUM PERIODIC_OCT_RECAL_AUTO
set_component_parameter_value PHY_LPDDR3_REF_CLK_FREQ_MHZ -1.0
set_component_parameter_value PHY_LPDDR3_PING_PONG_EN false
set_component_parameter_value PHY_LPDDR3_USER_AC_IO_STD_ENUM unset
set_component_parameter_value PHY_LPDDR3_USER_AC_MODE_ENUM unset
set_component_parameter_value PHY_LPDDR3_USER_AC_SLEW_RATE_ENUM SLEW_RATE_FAST
set_component_parameter_value PHY_LPDDR3_USER_CK_IO_STD_ENUM unset
set_component_parameter_value PHY_LPDDR3_USER_CK_MODE_ENUM unset
set_component_parameter_value PHY_LPDDR3_USER_CK_SLEW_RATE_ENUM SLEW_RATE_FAST
set_component_parameter_value PHY_LPDDR3_USER_DATA_IO_STD_ENUM unset
set_component_parameter_value PHY_LPDDR3_USER_DATA_OUT_MODE_ENUM unset
set_component_parameter_value PHY_LPDDR3_USER_DATA_IN_MODE_ENUM unset
set_component_parameter_value PHY_LPDDR3_USER_AUTO_STARTING_VREFIN_EN true
set_component_parameter_value PHY_LPDDR3_USER_STARTING_VREFIN 70.0
set_component_parameter_value PHY_LPDDR3_USER_PLL_REF_CLK_IO_STD_ENUM unset
set_component_parameter_value PHY_LPDDR3_USER_RZQ_IO_STD_ENUM unset
set_component_parameter_value PHY_LPDDR3_AC_IO_STD_ENUM unset
set_component_parameter_value PHY_LPDDR3_AC_MODE_ENUM unset
set_component_parameter_value PHY_LPDDR3_AC_SLEW_RATE_ENUM SLEW_RATE_FAST
set_component_parameter_value PHY_LPDDR3_CK_IO_STD_ENUM unset
set_component_parameter_value PHY_LPDDR3_CK_MODE_ENUM unset
set_component_parameter_value PHY_LPDDR3_CK_SLEW_RATE_ENUM SLEW_RATE_FAST
set_component_parameter_value PHY_LPDDR3_DATA_IO_STD_ENUM unset
set_component_parameter_value PHY_LPDDR3_DATA_OUT_MODE_ENUM unset
set_component_parameter_value PHY_LPDDR3_DATA_IN_MODE_ENUM unset
set_component_parameter_value PHY_LPDDR3_AUTO_STARTING_VREFIN_EN true
set_component_parameter_value PHY_LPDDR3_STARTING_VREFIN 70.0
set_component_parameter_value PHY_LPDDR3_PLL_REF_CLK_IO_STD_ENUM unset
set_component_parameter_value PHY_LPDDR3_RZQ_IO_STD_ENUM unset
set_component_parameter_value MEM_FORMAT_ENUM MEM_FORMAT_DISCRETE
set_component_parameter_value MEM_READ_LATENCY 20.0
set_component_parameter_value MEM_WRITE_LATENCY 17
set_component_parameter_value MEM_BURST_LENGTH 8
set_component_parameter_value MEM_DATA_MASK_EN true
set_component_parameter_value MEM_HAS_SIM_SUPPORT true
set_component_parameter_value MEM_NUM_OF_PHYSICAL_RANKS 1
set_component_parameter_value MEM_NUM_OF_LOGICAL_RANKS 1
set_component_parameter_value MEM_NUM_OF_DATA_ENDPOINTS 1
set_component_parameter_value MEM_TTL_DATA_WIDTH 32
set_component_parameter_value MEM_TTL_NUM_OF_READ_GROUPS 4
set_component_parameter_value MEM_TTL_NUM_OF_WRITE_GROUPS 4
set_component_parameter_value MEM_DDR3_FORMAT_ENUM MEM_FORMAT_DISCRETE
set_component_parameter_value MEM_DDR3_DQ_WIDTH 32
set_component_parameter_value MEM_DDR3_DQ_PER_DQS 8
set_component_parameter_value MEM_DDR3_DISCRETE_CS_WIDTH 1
set_component_parameter_value MEM_DDR3_NUM_OF_DIMMS 1
set_component_parameter_value MEM_DDR3_RANKS_PER_DIMM 1
set_component_parameter_value MEM_DDR3_CKE_PER_DIMM 1
set_component_parameter_value MEM_DDR3_CK_WIDTH 1
set_component_parameter_value MEM_DDR3_ROW_ADDR_WIDTH 16
set_component_parameter_value MEM_DDR3_COL_ADDR_WIDTH 10
set_component_parameter_value MEM_DDR3_BANK_ADDR_WIDTH 3
set_component_parameter_value MEM_DDR3_DM_EN true
set_component_parameter_value MEM_DDR3_DISCRETE_MIRROR_ADDRESSING_EN false
set_component_parameter_value MEM_DDR3_MIRROR_ADDRESSING_EN true
set_component_parameter_value MEM_DDR3_HIDE_ADV_MR_SETTINGS false
set_component_parameter_value MEM_DDR3_RDIMM_CONFIG 0000000000000000
set_component_parameter_value MEM_DDR3_LRDIMM_EXTENDED_CONFIG 000000000000000000
set_component_parameter_value MEM_DDR3_ALERT_N_PLACEMENT_ENUM DDR3_ALERT_N_PLACEMENT_AC_LANES
set_component_parameter_value MEM_DDR3_ALERT_N_DQS_GROUP 0
set_component_parameter_value MEM_DDR3_DQS_WIDTH 4
set_component_parameter_value MEM_DDR3_DM_WIDTH 4
set_component_parameter_value MEM_DDR3_CS_WIDTH 1
set_component_parameter_value MEM_DDR3_CS_PER_DIMM 1
set_component_parameter_value MEM_DDR3_CKE_WIDTH 1
set_component_parameter_value MEM_DDR3_ODT_WIDTH 1
set_component_parameter_value MEM_DDR3_ADDR_WIDTH 16
set_component_parameter_value MEM_DDR3_RM_WIDTH 0
set_component_parameter_value MEM_DDR3_AC_PAR_EN false
set_component_parameter_value MEM_DDR3_NUM_OF_PHYSICAL_RANKS 1
set_component_parameter_value MEM_DDR3_NUM_OF_LOGICAL_RANKS 1
set_component_parameter_value MEM_DDR3_TTL_DQS_WIDTH 4
set_component_parameter_value MEM_DDR3_TTL_DQ_WIDTH 32
set_component_parameter_value MEM_DDR3_TTL_DM_WIDTH 4
set_component_parameter_value MEM_DDR3_TTL_CS_WIDTH 1
set_component_parameter_value MEM_DDR3_TTL_CK_WIDTH 1
set_component_parameter_value MEM_DDR3_TTL_CKE_WIDTH 1
set_component_parameter_value MEM_DDR3_TTL_ODT_WIDTH 1
set_component_parameter_value MEM_DDR3_TTL_BANK_ADDR_WIDTH 3
set_component_parameter_value MEM_DDR3_TTL_ADDR_WIDTH 16
set_component_parameter_value MEM_DDR3_TTL_RM_WIDTH 0
set_component_parameter_value MEM_DDR3_TTL_NUM_OF_DIMMS 1
set_component_parameter_value MEM_DDR3_TTL_NUM_OF_PHYSICAL_RANKS 1
set_component_parameter_value MEM_DDR3_TTL_NUM_OF_LOGICAL_RANKS 1
set_component_parameter_value MEM_DDR3_MR0 3184
set_component_parameter_value MEM_DDR3_MR1 65558
set_component_parameter_value MEM_DDR3_MR2 131672
set_component_parameter_value MEM_DDR3_MR3 196608
set_component_parameter_value MEM_DDR3_ADDRESS_MIRROR_BITVEC 0
set_component_parameter_value MEM_DDR3_BL_ENUM DDR3_BL_BL8
set_component_parameter_value MEM_DDR3_BT_ENUM DDR3_BT_SEQUENTIAL
set_component_parameter_value MEM_DDR3_ASR_ENUM DDR3_ASR_AUTOMATIC
set_component_parameter_value MEM_DDR3_SRT_ENUM DDR3_SRT_NORMAL
set_component_parameter_value MEM_DDR3_PD_ENUM DDR3_PD_OFF
set_component_parameter_value MEM_DDR3_DRV_STR_ENUM DDR3_DRV_STR_RZQ_7
set_component_parameter_value MEM_DDR3_DLL_EN true
set_component_parameter_value MEM_DDR3_RTT_NOM_ENUM DDR3_RTT_NOM_RZQ_4
set_component_parameter_value MEM_DDR3_RTT_WR_ENUM DDR3_RTT_WR_RZQ_4
set_component_parameter_value MEM_DDR3_WTCL 8
set_component_parameter_value MEM_DDR3_ATCL_ENUM DDR3_ATCL_CL2
set_component_parameter_value MEM_DDR3_TCL 11
set_component_parameter_value MEM_DDR3_USE_DEFAULT_ODT true
set_component_parameter_value MEM_DDR3_R_ODTN_1X1 {Rank 0}
set_component_parameter_value MEM_DDR3_R_ODT0_1X1 off
set_component_parameter_value MEM_DDR3_W_ODTN_1X1 {Rank 0}
set_component_parameter_value MEM_DDR3_W_ODT0_1X1 on
set_component_parameter_value MEM_DDR3_R_ODTN_2X2 {Rank 0,Rank 1}
set_component_parameter_value MEM_DDR3_R_ODT0_2X2 off,off
set_component_parameter_value MEM_DDR3_R_ODT1_2X2 off,off
set_component_parameter_value MEM_DDR3_W_ODTN_2X2 {Rank 0,Rank 1}
set_component_parameter_value MEM_DDR3_W_ODT0_2X2 on,off
set_component_parameter_value MEM_DDR3_W_ODT1_2X2 off,on
set_component_parameter_value MEM_DDR3_R_ODTN_4X2 {Rank 0,Rank 1,Rank 2,Rank 3}
set_component_parameter_value MEM_DDR3_R_ODT0_4X2 off,off,on,on
set_component_parameter_value MEM_DDR3_R_ODT1_4X2 on,on,off,off
set_component_parameter_value MEM_DDR3_W_ODTN_4X2 {Rank 0,Rank 1,Rank 2,Rank 3}
set_component_parameter_value MEM_DDR3_W_ODT0_4X2 off,off,on,on
set_component_parameter_value MEM_DDR3_W_ODT1_4X2 on,on,off,off
set_component_parameter_value MEM_DDR3_R_ODTN_4X4 {Rank 0,Rank 1,Rank 2,Rank 3}
set_component_parameter_value MEM_DDR3_R_ODT0_4X4 off,off,on,off
set_component_parameter_value MEM_DDR3_R_ODT1_4X4 off,off,off,on
set_component_parameter_value MEM_DDR3_R_ODT2_4X4 on,off,off,off
set_component_parameter_value MEM_DDR3_R_ODT3_4X4 off,on,off,off
set_component_parameter_value MEM_DDR3_W_ODTN_4X4 {Rank 0,Rank 1,Rank 2,Rank 3}
set_component_parameter_value MEM_DDR3_W_ODT0_4X4 on,off,on,off
set_component_parameter_value MEM_DDR3_W_ODT1_4X4 off,on,off,on
set_component_parameter_value MEM_DDR3_W_ODT2_4X4 on,off,on,off
set_component_parameter_value MEM_DDR3_W_ODT3_4X4 off,on,off,on
set_component_parameter_value MEM_DDR3_R_DERIVED_ODTN {Rank 0,-,-,-}
set_component_parameter_value MEM_DDR3_R_DERIVED_ODT0 {(Drive) RZQ/7,-,-,-}
set_component_parameter_value MEM_DDR3_R_DERIVED_ODT1 -,-,-,-
set_component_parameter_value MEM_DDR3_R_DERIVED_ODT2 -,-,-,-
set_component_parameter_value MEM_DDR3_R_DERIVED_ODT3 -,-,-,-
set_component_parameter_value MEM_DDR3_W_DERIVED_ODTN {Rank 0,-,-,-}
set_component_parameter_value MEM_DDR3_W_DERIVED_ODT0 {(Dynamic) RZQ/4,-,-,-}
set_component_parameter_value MEM_DDR3_W_DERIVED_ODT1 -,-,-,-
set_component_parameter_value MEM_DDR3_W_DERIVED_ODT2 -,-,-,-
set_component_parameter_value MEM_DDR3_W_DERIVED_ODT3 -,-,-,-
set_component_parameter_value MEM_DDR3_SEQ_ODT_TABLE_LO 4
set_component_parameter_value MEM_DDR3_SEQ_ODT_TABLE_HI 0
set_component_parameter_value MEM_DDR3_CTRL_CFG_READ_ODT_CHIP 0
set_component_parameter_value MEM_DDR3_CTRL_CFG_WRITE_ODT_CHIP 1
set_component_parameter_value MEM_DDR3_CTRL_CFG_READ_ODT_RANK 0
set_component_parameter_value MEM_DDR3_CTRL_CFG_WRITE_ODT_RANK 1
set_component_parameter_value MEM_DDR3_SPEEDBIN_ENUM DDR3_SPEEDBIN_1600
set_component_parameter_value MEM_DDR3_TIS_PS 185
set_component_parameter_value MEM_DDR3_TIS_AC_MV 135
set_component_parameter_value MEM_DDR3_TIH_PS 130
set_component_parameter_value MEM_DDR3_TIH_DC_MV 90
set_component_parameter_value MEM_DDR3_TDS_PS 25
set_component_parameter_value MEM_DDR3_TDS_AC_MV 135
set_component_parameter_value MEM_DDR3_TDH_PS 50
set_component_parameter_value MEM_DDR3_TDH_DC_MV 90
set_component_parameter_value MEM_DDR3_TDQSQ_PS 100
set_component_parameter_value MEM_DDR3_TQH_CYC 0.38
set_component_parameter_value MEM_DDR3_TDQSCK_PS 150
set_component_parameter_value MEM_DDR3_TDQSS_CYC 0.27
set_component_parameter_value MEM_DDR3_TQSH_CYC 0.4
set_component_parameter_value MEM_DDR3_TDSH_CYC 0.18
set_component_parameter_value MEM_DDR3_TWLS_PS 165.0
set_component_parameter_value MEM_DDR3_TWLH_PS 165.0
set_component_parameter_value MEM_DDR3_TDSS_CYC 0.18
set_component_parameter_value MEM_DDR3_TINIT_US 500
set_component_parameter_value MEM_DDR3_TMRD_CK_CYC 4
set_component_parameter_value MEM_DDR3_TRAS_NS 35.0
set_component_parameter_value MEM_DDR3_TRCD_NS 13.75
set_component_parameter_value MEM_DDR3_TRP_NS 13.75
set_component_parameter_value MEM_DDR3_TREFI_US 4.0
set_component_parameter_value MEM_DDR3_TRFC_NS 350.0
set_component_parameter_value MEM_DDR3_TWR_NS 15.0
set_component_parameter_value MEM_DDR3_TWTR_CYC 4
set_component_parameter_value MEM_DDR3_TFAW_NS 40.0
set_component_parameter_value MEM_DDR3_TRRD_CYC 4
set_component_parameter_value MEM_DDR3_TRTP_CYC 4
set_component_parameter_value MEM_DDR3_TINIT_CK 400000
set_component_parameter_value MEM_DDR3_TDQSCK_DERV_PS 2
set_component_parameter_value MEM_DDR3_TDQSCKDS 450
set_component_parameter_value MEM_DDR3_TDQSCKDM 900
set_component_parameter_value MEM_DDR3_TDQSCKDL 1200
set_component_parameter_value MEM_DDR3_TRAS_CYC 28
set_component_parameter_value MEM_DDR3_TRCD_CYC 11
set_component_parameter_value MEM_DDR3_TRP_CYC 11
set_component_parameter_value MEM_DDR3_TRFC_CYC 280
set_component_parameter_value MEM_DDR3_TWR_CYC 12
set_component_parameter_value MEM_DDR3_TFAW_CYC 32
set_component_parameter_value MEM_DDR3_TREFI_CYC 3200
set_component_parameter_value MEM_DDR3_CFG_GEN_SBE false
set_component_parameter_value MEM_DDR3_CFG_GEN_DBE false
set_component_parameter_value MEM_DDR4_FORMAT_ENUM MEM_FORMAT_UDIMM
set_component_parameter_value MEM_DDR4_DQ_WIDTH 72
set_component_parameter_value MEM_DDR4_DQ_PER_DQS 8
set_component_parameter_value MEM_DDR4_DISCRETE_CS_WIDTH 1
set_component_parameter_value MEM_DDR4_NUM_OF_DIMMS 1
set_component_parameter_value MEM_DDR4_CHIP_ID_WIDTH 0
set_component_parameter_value MEM_DDR4_RANKS_PER_DIMM 1
set_component_parameter_value MEM_DDR4_CKE_PER_DIMM 1
set_component_parameter_value MEM_DDR4_CK_WIDTH 1
set_component_parameter_value MEM_DDR4_ROW_ADDR_WIDTH 15
set_component_parameter_value MEM_DDR4_COL_ADDR_WIDTH 10
set_component_parameter_value MEM_DDR4_BANK_ADDR_WIDTH 2
set_component_parameter_value MEM_DDR4_BANK_GROUP_WIDTH 2
set_component_parameter_value MEM_DDR4_DM_EN true
set_component_parameter_value MEM_DDR4_ALERT_PAR_EN true
set_component_parameter_value MEM_DDR4_ALERT_N_PLACEMENT_ENUM DDR4_ALERT_N_PLACEMENT_AUTO
set_component_parameter_value MEM_DDR4_ALERT_N_DQS_GROUP 0
set_component_parameter_value MEM_DDR4_ALERT_N_AC_LANE 0
set_component_parameter_value MEM_DDR4_ALERT_N_AC_PIN 0
set_component_parameter_value MEM_DDR4_DISCRETE_MIRROR_ADDRESSING_EN false
set_component_parameter_value MEM_DDR4_MIRROR_ADDRESSING_EN true
set_component_parameter_value MEM_DDR4_HIDE_ADV_MR_SETTINGS true
set_component_parameter_value MEM_DDR4_BL_ENUM DDR4_BL_BL8
set_component_parameter_value MEM_DDR4_BT_ENUM DDR4_BT_SEQUENTIAL
set_component_parameter_value MEM_DDR4_TCL 18
set_component_parameter_value MEM_DDR4_RTT_NOM_ENUM DDR4_RTT_NOM_RZQ_4
set_component_parameter_value MEM_DDR4_DLL_EN true
set_component_parameter_value MEM_DDR4_ATCL_ENUM DDR4_ATCL_DISABLED
set_component_parameter_value MEM_DDR4_DRV_STR_ENUM DDR4_DRV_STR_RZQ_7
set_component_parameter_value MEM_DDR4_ASR_ENUM DDR4_ASR_MANUAL_NORMAL
set_component_parameter_value MEM_DDR4_RTT_WR_ENUM DDR4_RTT_WR_ODT_DISABLED
set_component_parameter_value MEM_DDR4_WTCL 12
set_component_parameter_value MEM_DDR4_WRITE_CRC false
set_component_parameter_value MEM_DDR4_GEARDOWN DDR4_GEARDOWN_HR
set_component_parameter_value MEM_DDR4_PER_DRAM_ADDR false
set_component_parameter_value MEM_DDR4_TEMP_SENSOR_READOUT false
set_component_parameter_value MEM_DDR4_FINE_GRANULARITY_REFRESH DDR4_FINE_REFRESH_FIXED_1X
set_component_parameter_value MEM_DDR4_MPR_READ_FORMAT DDR4_MPR_READ_FORMAT_SERIAL
set_component_parameter_value MEM_DDR4_MAX_POWERDOWN false
set_component_parameter_value MEM_DDR4_TEMP_CONTROLLED_RFSH_RANGE DDR4_TEMP_CONTROLLED_RFSH_NORMAL
set_component_parameter_value MEM_DDR4_TEMP_CONTROLLED_RFSH_ENA false
set_component_parameter_value MEM_DDR4_INTERNAL_VREFDQ_MONITOR false
set_component_parameter_value MEM_DDR4_CAL_MODE 0
set_component_parameter_value MEM_DDR4_SELF_RFSH_ABORT false
set_component_parameter_value MEM_DDR4_READ_PREAMBLE_TRAINING false
set_component_parameter_value MEM_DDR4_READ_PREAMBLE 2
set_component_parameter_value MEM_DDR4_WRITE_PREAMBLE 1
set_component_parameter_value MEM_DDR4_AC_PARITY_LATENCY DDR4_AC_PARITY_LATENCY_DISABLE
set_component_parameter_value MEM_DDR4_ODT_IN_POWERDOWN true
set_component_parameter_value MEM_DDR4_RTT_PARK DDR4_RTT_PARK_ODT_DISABLED
set_component_parameter_value MEM_DDR4_AC_PERSISTENT_ERROR false
set_component_parameter_value MEM_DDR4_WRITE_DBI false
set_component_parameter_value MEM_DDR4_READ_DBI true
set_component_parameter_value MEM_DDR4_DEFAULT_VREFOUT true
set_component_parameter_value MEM_DDR4_USER_VREFDQ_TRAINING_VALUE 56.0
set_component_parameter_value MEM_DDR4_USER_VREFDQ_TRAINING_RANGE DDR4_VREFDQ_TRAINING_RANGE_1
set_component_parameter_value MEM_DDR4_RCD_CA_IBT_ENUM DDR4_RCD_CA_IBT_100
set_component_parameter_value MEM_DDR4_RCD_CS_IBT_ENUM DDR4_RCD_CS_IBT_100
set_component_parameter_value MEM_DDR4_RCD_CKE_IBT_ENUM DDR4_RCD_CKE_IBT_100
set_component_parameter_value MEM_DDR4_RCD_ODT_IBT_ENUM DDR4_RCD_ODT_IBT_100
set_component_parameter_value MEM_DDR4_DB_RTT_NOM_ENUM DDR4_DB_RTT_NOM_ODT_DISABLED
set_component_parameter_value MEM_DDR4_DB_RTT_WR_ENUM DDR4_DB_RTT_WR_RZQ_3
set_component_parameter_value MEM_DDR4_DB_RTT_PARK_ENUM DDR4_DB_RTT_PARK_ODT_DISABLED
set_component_parameter_value MEM_DDR4_DB_DQ_DRV_ENUM DDR4_DB_DRV_STR_RZQ_7
set_component_parameter_value MEM_DDR4_SPD_137_RCD_CA_DRV 101
set_component_parameter_value MEM_DDR4_SPD_138_RCD_CK_DRV 5
set_component_parameter_value MEM_DDR4_SPD_140_DRAM_VREFDQ_R0 29
set_component_parameter_value MEM_DDR4_SPD_141_DRAM_VREFDQ_R1 29
set_component_parameter_value MEM_DDR4_SPD_142_DRAM_VREFDQ_R2 29
set_component_parameter_value MEM_DDR4_SPD_143_DRAM_VREFDQ_R3 29
set_component_parameter_value MEM_DDR4_SPD_144_DB_VREFDQ 37
set_component_parameter_value MEM_DDR4_SPD_145_DB_MDQ_DRV 21
set_component_parameter_value MEM_DDR4_SPD_148_DRAM_DRV 0
set_component_parameter_value MEM_DDR4_SPD_149_DRAM_RTT_WR_NOM 20
set_component_parameter_value MEM_DDR4_SPD_152_DRAM_RTT_PARK 39
set_component_parameter_value MEM_DDR4_SPD_133_RCD_DB_VENDOR_LSB 0
set_component_parameter_value MEM_DDR4_SPD_134_RCD_DB_VENDOR_MSB 0
set_component_parameter_value MEM_DDR4_SPD_135_RCD_REV 0
set_component_parameter_value MEM_DDR4_SPD_139_DB_REV 0
set_component_parameter_value MEM_DDR4_LRDIMM_ODT_LESS_BS true
set_component_parameter_value MEM_DDR4_LRDIMM_ODT_LESS_BS_PARK_OHM 240
set_component_parameter_value MEM_DDR4_DQS_WIDTH 8
set_component_parameter_value MEM_DDR4_CS_WIDTH 1
set_component_parameter_value MEM_DDR4_CS_PER_DIMM 1
set_component_parameter_value MEM_DDR4_CKE_WIDTH 1
set_component_parameter_value MEM_DDR4_ODT_WIDTH 1
set_component_parameter_value MEM_DDR4_ADDR_WIDTH 1
set_component_parameter_value MEM_DDR4_RM_WIDTH 0
set_component_parameter_value MEM_DDR4_NUM_OF_PHYSICAL_RANKS 1
set_component_parameter_value MEM_DDR4_NUM_OF_LOGICAL_RANKS 1
set_component_parameter_value MEM_DDR4_IDEAL_VREF_IN_PCT 60.0
set_component_parameter_value MEM_DDR4_IDEAL_VREF_OUT_PCT 60.0
set_component_parameter_value MEM_DDR4_VREFDQ_TRAINING_VALUE 56.0
set_component_parameter_value MEM_DDR4_VREFDQ_TRAINING_RANGE DDR4_VREFDQ_TRAINING_RANGE_1
set_component_parameter_value MEM_DDR4_VREFDQ_TRAINING_RANGE_DISP {Range 2 - 45% to 77.5%}
set_component_parameter_value MEM_DDR4_TTL_DQS_WIDTH 8
set_component_parameter_value MEM_DDR4_TTL_DQ_WIDTH 72
set_component_parameter_value MEM_DDR4_TTL_CS_WIDTH 1
set_component_parameter_value MEM_DDR4_TTL_CK_WIDTH 1
set_component_parameter_value MEM_DDR4_TTL_CKE_WIDTH 1
set_component_parameter_value MEM_DDR4_TTL_ODT_WIDTH 1
set_component_parameter_value MEM_DDR4_TTL_BANK_ADDR_WIDTH 2
set_component_parameter_value MEM_DDR4_TTL_BANK_GROUP_WIDTH 2
set_component_parameter_value MEM_DDR4_TTL_CHIP_ID_WIDTH 0
set_component_parameter_value MEM_DDR4_TTL_ADDR_WIDTH 1
set_component_parameter_value MEM_DDR4_TTL_RM_WIDTH 0
set_component_parameter_value MEM_DDR4_TTL_NUM_OF_DIMMS 1
set_component_parameter_value MEM_DDR4_TTL_NUM_OF_PHYSICAL_RANKS 1
set_component_parameter_value MEM_DDR4_TTL_NUM_OF_LOGICAL_RANKS 1
set_component_parameter_value MEM_DDR4_MR0 0
set_component_parameter_value MEM_DDR4_MR1 0
set_component_parameter_value MEM_DDR4_MR2 0
set_component_parameter_value MEM_DDR4_MR3 0
set_component_parameter_value MEM_DDR4_MR4 0
set_component_parameter_value MEM_DDR4_MR5 0
set_component_parameter_value MEM_DDR4_MR6 0
set_component_parameter_value MEM_DDR4_ADDRESS_MIRROR_BITVEC 0
set_component_parameter_value MEM_DDR4_RCD_PARITY_CONTROL_WORD 13
set_component_parameter_value MEM_DDR4_RCD_COMMAND_LATENCY 1
set_component_parameter_value MEM_DDR4_USE_DEFAULT_ODT true
set_component_parameter_value MEM_DDR4_R_ODTN_1X1 {Rank 0}
set_component_parameter_value MEM_DDR4_R_ODT0_1X1 off
set_component_parameter_value MEM_DDR4_W_ODTN_1X1 {Rank 0}
set_component_parameter_value MEM_DDR4_W_ODT0_1X1 on
set_component_parameter_value MEM_DDR4_R_ODTN_2X2 {Rank 0,Rank 1}
set_component_parameter_value MEM_DDR4_R_ODT0_2X2 off,off
set_component_parameter_value MEM_DDR4_R_ODT1_2X2 off,off
set_component_parameter_value MEM_DDR4_W_ODTN_2X2 {Rank 0,Rank 1}
set_component_parameter_value MEM_DDR4_W_ODT0_2X2 on,off
set_component_parameter_value MEM_DDR4_W_ODT1_2X2 off,on
set_component_parameter_value MEM_DDR4_R_ODTN_4X2 {Rank 0,Rank 1,Rank 2,Rank 3}
set_component_parameter_value MEM_DDR4_R_ODT0_4X2 off,off,on,on
set_component_parameter_value MEM_DDR4_R_ODT1_4X2 on,on,off,off
set_component_parameter_value MEM_DDR4_W_ODTN_4X2 {Rank 0,Rank 1,Rank 2,Rank 3}
set_component_parameter_value MEM_DDR4_W_ODT0_4X2 off,off,on,on
set_component_parameter_value MEM_DDR4_W_ODT1_4X2 on,on,off,off
set_component_parameter_value MEM_DDR4_R_ODTN_4X4 {Rank 0,Rank 1,Rank 2,Rank 3}
set_component_parameter_value MEM_DDR4_R_ODT0_4X4 off,off,on,off
set_component_parameter_value MEM_DDR4_R_ODT1_4X4 off,off,off,on
set_component_parameter_value MEM_DDR4_R_ODT2_4X4 on,off,off,off
set_component_parameter_value MEM_DDR4_R_ODT3_4X4 off,on,off,off
set_component_parameter_value MEM_DDR4_W_ODTN_4X4 {Rank 0,Rank 1,Rank 2,Rank 3}
set_component_parameter_value MEM_DDR4_W_ODT0_4X4 on,off,on,off
set_component_parameter_value MEM_DDR4_W_ODT1_4X4 off,on,off,on
set_component_parameter_value MEM_DDR4_W_ODT2_4X4 on,off,on,off
set_component_parameter_value MEM_DDR4_W_ODT3_4X4 off,on,off,on
set_component_parameter_value MEM_DDR4_R_DERIVED_ODTN ,,
set_component_parameter_value MEM_DDR4_R_DERIVED_ODT0 ,,
set_component_parameter_value MEM_DDR4_R_DERIVED_ODT1 ,,
set_component_parameter_value MEM_DDR4_R_DERIVED_ODT2 ,,
set_component_parameter_value MEM_DDR4_R_DERIVED_ODT3 ,,
set_component_parameter_value MEM_DDR4_W_DERIVED_ODTN ,,
set_component_parameter_value MEM_DDR4_W_DERIVED_ODT0 ,,
set_component_parameter_value MEM_DDR4_W_DERIVED_ODT1 ,,
set_component_parameter_value MEM_DDR4_W_DERIVED_ODT2 ,,
